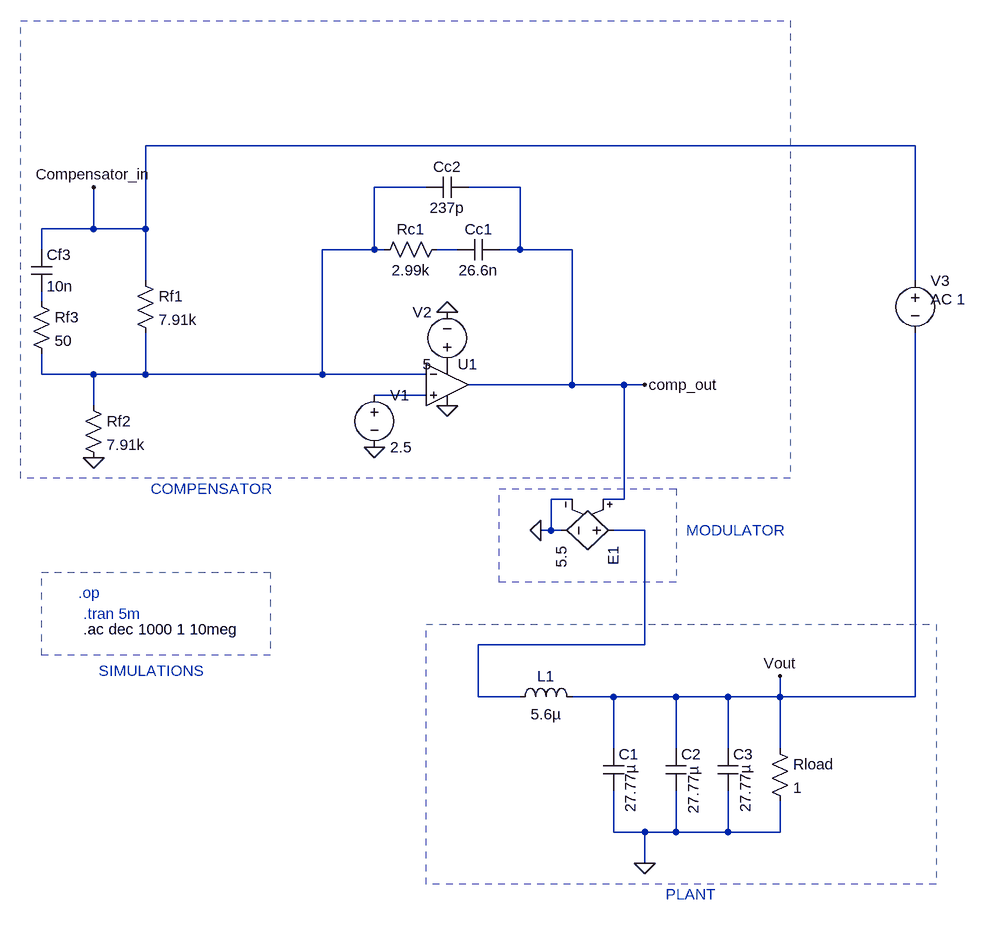
[diagram p0: schematic compensator_and_plant.asc]
compensator_and_plant.asc, the LTspice schematic file:
Version 4.1
SHEET 1 1728 680
WIRE 1648 -544 464 -544
WIRE 896 -480 816 -480
WIRE 1040 -480 960 -480
WIRE 384 -416 384 -480
WIRE 384 -416 304 -416
WIRE 464 -416 464 -544
WIRE 464 -416 384 -416
WIRE 304 -384 304 -416
WIRE 816 -384 816 -480
WIRE 816 -384 736 -384
WIRE 832 -384 816 -384
WIRE 944 -384 912 -384
WIRE 1040 -384 1040 -480
WIRE 1040 -384 1008 -384
WIRE 1120 -384 1040 -384
WIRE 464 -336 464 -416
WIRE 1648 -336 1648 -544
WIRE 304 -304 304 -320
WIRE 304 -192 304 -224
WIRE 384 -192 304 -192
WIRE 464 -192 464 -256
WIRE 464 -192 384 -192
WIRE 736 -192 736 -384
WIRE 736 -192 464 -192
WIRE 896 -192 736 -192
WIRE 1120 -176 1120 -384
WIRE 1120 -176 960 -176
WIRE 1200 -176 1120 -176
WIRE 1232 -176 1200 -176
WIRE 896 -160 816 -160
WIRE 384 -144 384 -192
WIRE 1120 0 1088 0
WIRE 1200 0 1200 -176
WIRE 1200 0 1168 0
WIRE 1088 48 1088 0
WIRE 1088 48 1072 48
WIRE 1104 48 1088 48
WIRE 1232 48 1184 48
WIRE 1232 224 1232 48
WIRE 1232 224 976 224
WIRE 976 304 976 224
WIRE 1040 304 976 304
WIRE 1184 304 1120 304
WIRE 1280 304 1184 304
WIRE 1360 304 1280 304
WIRE 1440 304 1440 272
WIRE 1440 304 1360 304
WIRE 1648 304 1648 -256
WIRE 1648 304 1440 304
WIRE 1184 384 1184 304
WIRE 1280 384 1280 304
WIRE 1360 384 1360 304
WIRE 1440 384 1440 304
WIRE 1184 512 1184 448
WIRE 1232 512 1184 512
WIRE 1280 512 1280 448
WIRE 1280 512 1232 512
WIRE 1360 512 1360 448
WIRE 1360 512 1280 512
WIRE 1440 512 1440 464
WIRE 1440 512 1360 512
WIRE 1232 560 1232 512
FLAG 1232 560 0
FLAG 816 -80 0
FLAG 384 -64 0
FLAG 928 -288 0
FLAG 928 -144 0
FLAG 384 -480 Compensator_in
FLAG 1232 -176 comp_out
FLAG 1072 48 0
FLAG 1440 272 Vout
SYMBOL cap 1168 384 R0
WINDOW 3 42 24 VRight 2
SYMATTR Value 27.77µ
SYMATTR InstName C1
SYMATTR SpiceLine V=25 Rser=2.94m Lser=0.6n
SYMBOL ind 1024 320 R270
WINDOW 0 32 56 VTop 2
WINDOW 3 5 56 VBottom 2
SYMATTR InstName L1
SYMATTR Value 5.6µ
SYMATTR SpiceLine Rser=1m
SYMBOL OpAmps\\UniversalOpAmp 928 -176 R0
SYMATTR InstName U1
SYMBOL voltage 816 -176 R0
WINDOW 123 0 0 Left 0
WINDOW 39 0 0 Left 0
SYMATTR InstName V1
SYMATTR Value 2.5
SYMBOL res 448 -352 R0
SYMATTR InstName Rf1
SYMATTR Value 7.91k
SYMBOL res 288 -320 R0
SYMATTR InstName Rf3
SYMATTR Value 50
SYMBOL cap 288 -384 R0
SYMATTR InstName Cf3
SYMATTR Value 10n
SYMBOL res 928 -400 R90
WINDOW 0 0 56 VBottom 2
WINDOW 3 32 56 VTop 2
SYMATTR InstName Rc1
SYMATTR Value 2.99k
SYMBOL cap 960 -496 R90
WINDOW 0 0 32 VBottom 2
WINDOW 3 32 32 VTop 2
SYMATTR InstName Cc2
SYMATTR Value 237p
SYMBOL res 368 -160 R0
SYMATTR InstName Rf2
SYMATTR Value 7.91k
SYMBOL voltage 928 -192 R180
WINDOW 0 24 96 Left 2
WINDOW 3 24 16 Left 2
WINDOW 123 0 0 Left 0
WINDOW 39 0 0 Left 0
SYMATTR InstName V2
SYMATTR Value 5
SYMBOL cap 1008 -400 R90
WINDOW 0 0 32 VBottom 2
WINDOW 3 32 32 VTop 2
SYMATTR InstName Cc1
SYMATTR Value 26.6n
SYMBOL cap 1264 384 R0
WINDOW 3 43 26 VRight 2
SYMATTR Value 27.77µ
SYMATTR InstName C2
SYMATTR SpiceLine V=25 Rser=2.94m Lser=0.6n
SYMBOL cap 1344 384 R0
WINDOW 3 43 24 VRight 2
SYMATTR Value 27.77µ
SYMATTR InstName C3
SYMATTR SpiceLine V=25 Rser=2.94m Lser=0.6n
SYMBOL e 1200 48 R90
SYMATTR InstName E1
SYMATTR Value 5.5
SYMBOL res 1424 368 R0
SYMATTR InstName Rload
SYMATTR Value 1
SYMBOL voltage 1648 -352 R0
WINDOW 123 24 44 Left 2
WINDOW 39 0 0 Left 0
SYMATTR Value2 AC 1
SYMATTR InstName V3
SYMATTR Value ""
TEXT 360 144 Left 2 ;.op
TEXT 368 200 Left 2 !.ac dec 1000 1 10meg
TEXT 472 -16 Left 2 ;COMPENSATOR
TEXT 1296 48 Left 2 ;MODULATOR
TEXT 1264 608 Left 2 ;PLANT
TEXT 392 264 Left 2 ;SIMULATIONS
TEXT 368 176 Left 2 ;.tran 5m
RECTANGLE Normal 1456 -32 272 -736 2
RECTANGLE Normal 1280 128 1008 -16 2
RECTANGLE Normal 1680 592 896 192 2
RECTANGLE Normal 656 240 304 112 2

The netlist it stands for:
* compensator_and_plant.asc
C1 Vout 0 27.77µ V=25 Rser=2.94m Lser=0.6n
L1 N005 Vout 5.6µ Rser=1m
X§U1 N004 N001 P001 0 comp_out level1 Avol=1Meg GBW=10Meg Vos=0 En=0 Enk=0 In=0 Ink=0 Rin=500Meg  ; pins In+ In- V+ V- OUT
V1 N004 0 2.5
Rf1 Compensator_in N001 7.91k
Rf3 N003 N001 50
Cf3 Compensator_in N003 10n
Rc1 N002 N001 2.99k
Cc2 comp_out N001 237p
Rf2 N001 0 7.91k
V2 P001 0 5
Cc1 comp_out N002 26.6n
C2 Vout 0 27.77µ V=25 Rser=2.94m Lser=0.6n
C3 Vout 0 27.77µ V=25 Rser=2.94m Lser=0.6n
E1 N005 0 comp_out 0 5.5
Rload Vout 0 1
V3 Compensator_in Vout AC 1
* .op
.ac dec 1000 1 10meg
* COMPENSATOR
* MODULATOR
* PLANT
* SIMULATIONS
* .tran 5m
.lib UniversalOpAmp1.lib
.backanno
.end